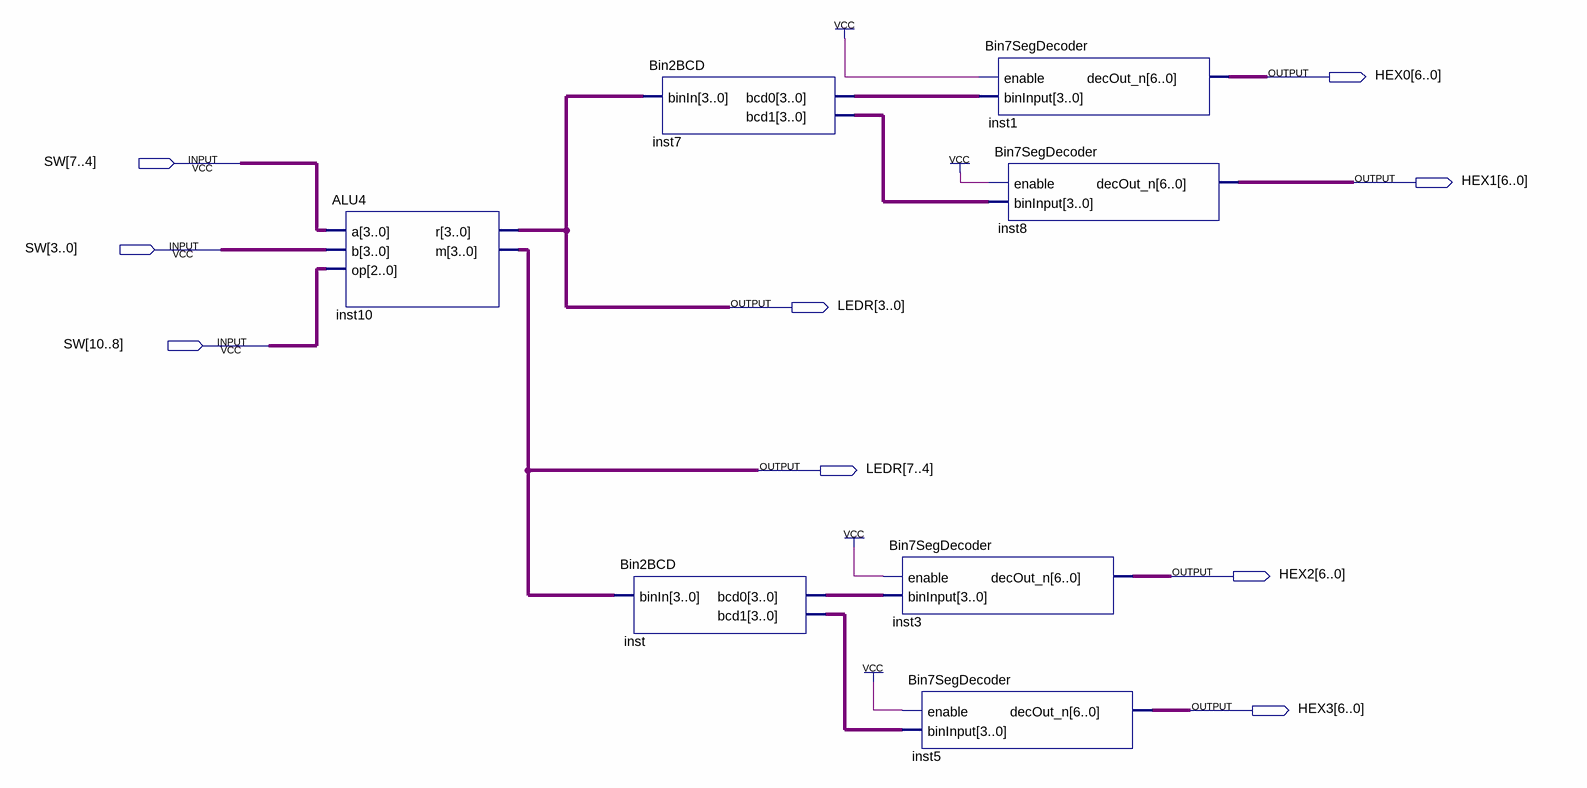
[diagram p0: schematic sheet]
// Quartus schematic ALUDemo.bdf as structural Verilog: 7 symbols, 9 pins
module ALUDemo (
  input  [10:0] SW,
  output [6:0] HEX0,
  output [6:0] HEX1,
  output [7:0] LEDR,
  output [6:0] HEX2,
  output [6:0] HEX3
);

  wire [3:0] inst7_bcd0, inst7_bcd1, inst_bcd0, inst_bcd1;

  ALU4 inst10 (.a(SW[7:4]), .b(SW[3:0]), .op(SW[10:8]), .r(LEDR[3:0]), .m(LEDR[7:4]));
  Bin2BCD inst7 (.binIn(LEDR[3:0]), .bcd0(inst7_bcd0), .bcd1(inst7_bcd1));
  Bin2BCD inst (.binIn(LEDR[7:4]), .bcd0(inst_bcd0), .bcd1(inst_bcd1));
  Bin7SegDecoder inst3 (.enable(1'b1), .binInput(inst_bcd0), .decOut_n(HEX2));
  Bin7SegDecoder inst5 (.enable(1'b1), .binInput(inst_bcd1), .decOut_n(HEX3));
  Bin7SegDecoder inst1 (.enable(1'b1), .binInput(inst7_bcd0), .decOut_n(HEX0));
  Bin7SegDecoder inst8 (.enable(1'b1), .binInput(inst7_bcd1), .decOut_n(HEX1));
endmodule
